# Altium schematic sheet DSO_Counters.SchDoc: Schematic_Name
size A4; CompanyName: University of Melbourne; DrawnBy: Student_#; Engineer: Your Name Here; Organization: University of Melbourne; DocumentNumber: 5; Revision: 0.1; SheetNumber: 5; SheetTotal: 10; Title_Project: Project_Title
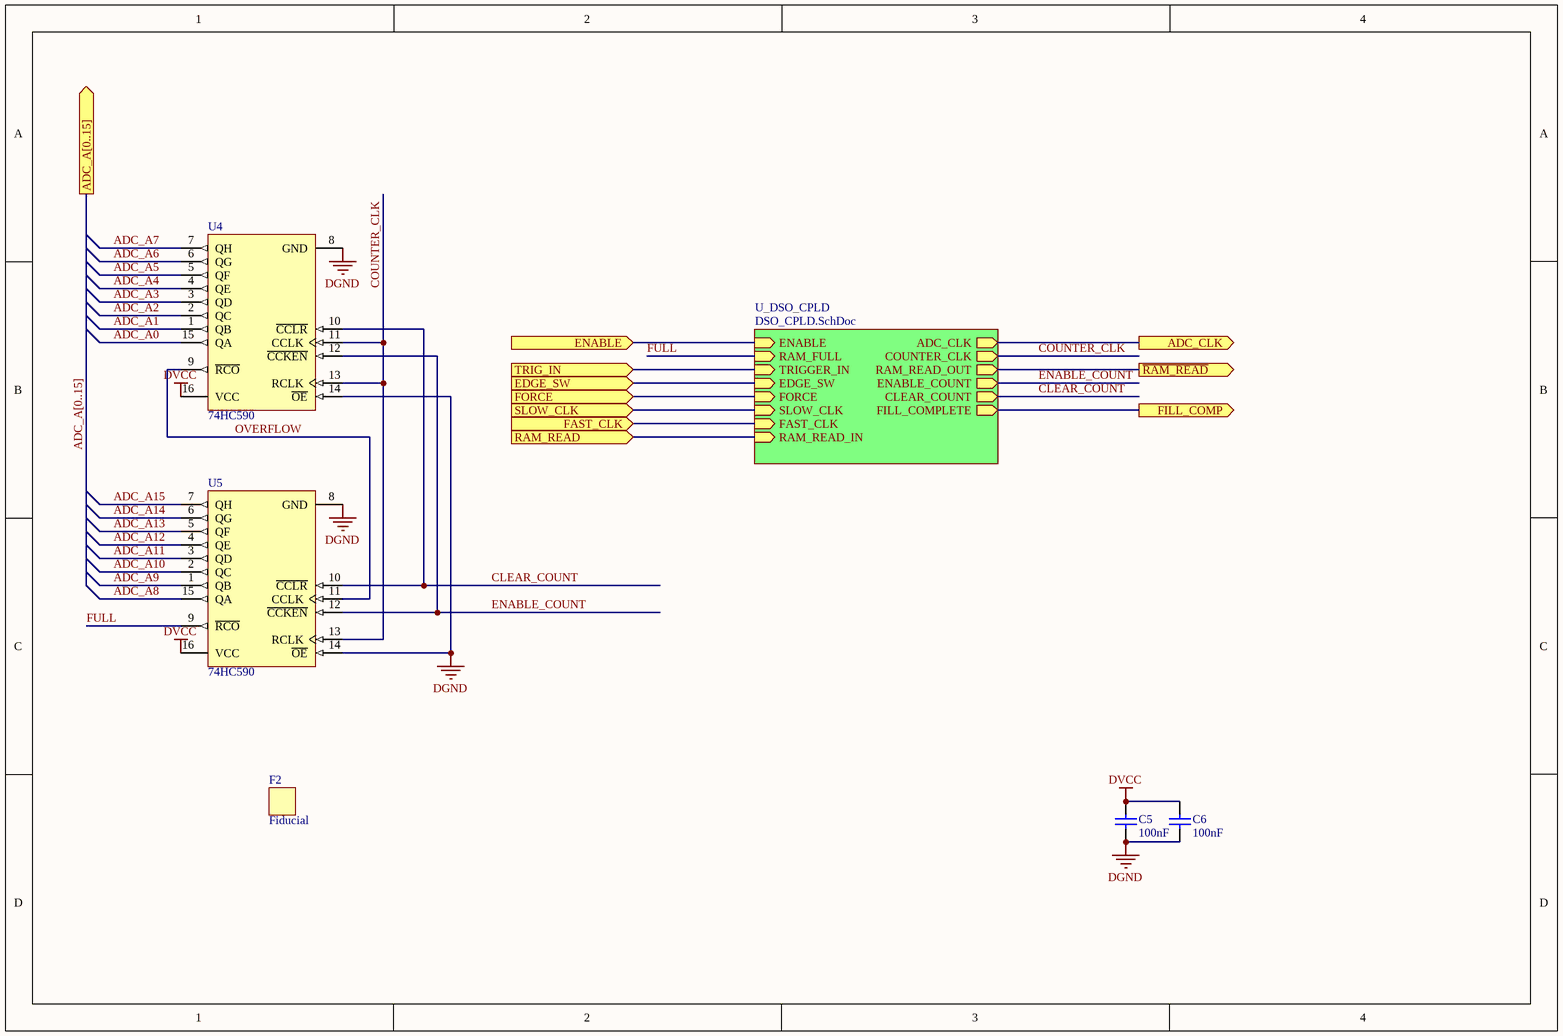
[diagram p0: DSO_Counters.SchDoc]

## Parts
C5  100nF  [0805C]
C6  100nF  [0805C]
F2  Fiducial  [Fiducial]  (no BOM)
U4  74HC590  [SOIC-16]
U5  74HC590  [SOIC-16]

## Sub-sheets
U_DSO_CPLD = DSO_CPLD.SchDoc: ENABLE (in), RAM_FULL (in), TRIGGER_IN (in), EDGE_SW (in), FORCE (in), SLOW_CLK (in), FAST_CLK (in), RAM_READ_IN (in), ADC_CLK (out), COUNTER_CLK (out), RAM_READ_OUT (out), ENABLE_COUNT (out), CLEAR_COUNT (out), FILL_COMPLETE (out)

## Ports
ADC_A[0..15] (out), ADC_CLK (out), EDGE_SW (in), ENABLE (in), FAST_CLK (in), FILL_COMP (out), FORCE (in), RAM_READ (in), SLOW_CLK (in), TRIG_IN (in), ~{RAM_READ} (out)

## Nets
DGND: C5.2 C6.2 U4.8(GND) U4.14(~{OE}) U5.8(GND) U5.14(~{OE})
DVCC: C5.1 C6.1 U4.16(VCC) U5.16(VCC)
ADC_A0: U4.15(QA)
ADC_A1: U4.1(QB)
ADC_A2: U4.2(QC)
ADC_A3: U4.3(QD)
ADC_A4: U4.4(QE)
ADC_A5: U4.5(QF)
ADC_A6: U4.6(QG)
ADC_A7: U4.7(QH)
ADC_A8: U5.15(QA)
ADC_A9: U5.1(QB)
ADC_A10: U5.2(QC)
ADC_A11: U5.3(QD)
ADC_A12: U5.4(QE)
ADC_A13: U5.5(QF)
ADC_A14: U5.6(QG)
ADC_A15: U5.7(QH)
ADC_CLK: port ADC_CLK, sheet U_DSO_CPLD/ADC_CLK
CLEAR_COUNT: U4.10(~{CCLR}) U5.10(~{CCLR}) ; sheet U_DSO_CPLD/CLEAR_COUNT
COUNTER_CLK: U4.11(CCLK) U4.13(RCLK) U5.13(RCLK) ; sheet U_DSO_CPLD/COUNTER_CLK
EDGE_SW: port EDGE_SW, sheet U_DSO_CPLD/EDGE_SW
ENABLE: port ENABLE, sheet U_DSO_CPLD/ENABLE
ENABLE_COUNT: U4.12(~{CCKEN}) U5.12(~{CCKEN}) ; sheet U_DSO_CPLD/ENABLE_COUNT
FAST_CLK: port FAST_CLK, sheet U_DSO_CPLD/FAST_CLK
FILL_COMP: port FILL_COMP, sheet U_DSO_CPLD/FILL_COMPLETE
FORCE: port FORCE, sheet U_DSO_CPLD/FORCE
FULL: U5.9(~{RCO}) ; sheet U_DSO_CPLD/RAM_FULL
OVERFLOW: U4.9(~{RCO}) U5.11(CCLK)
~{RAM_READ}: port ~{RAM_READ}, sheet U_DSO_CPLD/RAM_READ_OUT
RAM_READ: port RAM_READ, sheet U_DSO_CPLD/RAM_READ_IN
SLOW_CLK: port SLOW_CLK, sheet U_DSO_CPLD/SLOW_CLK
TRIG_IN: port TRIG_IN, sheet U_DSO_CPLD/TRIGGER_IN

## Buses and harness runs
bus ADC_A[0..15] = port ADC_A[0..15]

## Library data of the parts
C5 C6 = C: Capacitor; Reviewed by: RM - 2018/08/05; Revision: July-2002: Re-released for DXP Platform.; Value: 100nF; Supplier 1: *; Supplier Part Number 1: *
U4 U5 = 74HC590: 8-Bit Binary Counter Register; Reviewed by: RM - 2018/08/05; ComponentLink1Description: Manufacturer Link; ComponentLink1URL: http://www.st.com/; ComponentLink2Description: Datasheet; ComponentLink2URL: http://www.st.com/stonline/products/literature/ds/1986/m74hc590.pdf; Supplier 1: Digi-Key; Supplier Part Number 1: 296-17132-1-ND